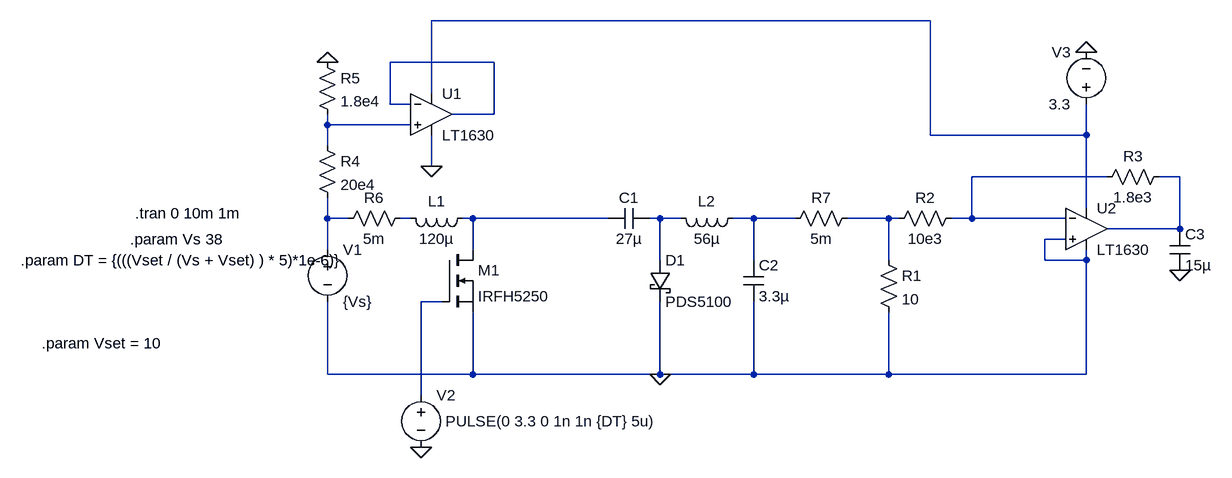
[diagram p0: schematic cuk_converter2.asc]
cuk_converter2.asc, the LTspice schematic file:
Version 4
SHEET 1 1320 680
WIRE 880 -208 112 -208
WIRE 208 -144 48 -144
WIRE 112 -96 112 -208
WIRE 48 -80 48 -144
WIRE 80 -80 48 -80
WIRE 208 -64 208 -144
WIRE 208 -64 144 -64
WIRE -48 -48 -48 -64
WIRE 80 -48 -48 -48
WIRE 880 -32 880 -208
WIRE 1120 -32 1120 -80
WIRE 1120 -32 880 -32
WIRE -48 -16 -48 -48
WIRE 112 16 112 -32
WIRE 1152 32 944 32
WIRE 1264 32 1232 32
WIRE 1120 80 1120 -32
WIRE -48 96 -48 64
WIRE -16 96 -48 96
WIRE 80 96 64 96
WIRE 176 96 160 96
WIRE 384 96 176 96
WIRE 464 96 448 96
WIRE 496 96 464 96
WIRE 608 96 576 96
WIRE 672 96 608 96
WIRE 816 96 752 96
WIRE 832 96 816 96
WIRE 944 96 944 32
WIRE 944 96 912 96
WIRE 1088 96 944 96
WIRE 1264 112 1264 32
WIRE 1264 112 1152 112
WIRE 1088 128 1056 128
WIRE -48 144 -48 96
WIRE 176 144 176 96
WIRE 464 160 464 96
WIRE 608 160 608 96
WIRE 816 160 816 96
WIRE 1056 160 1056 128
WIRE 1120 160 1120 144
WIRE 1120 160 1056 160
WIRE 128 224 96 224
WIRE -48 336 -48 224
WIRE 176 336 176 240
WIRE 176 336 -48 336
WIRE 464 336 464 224
WIRE 464 336 176 336
WIRE 608 336 608 224
WIRE 608 336 464 336
WIRE 816 336 816 240
WIRE 816 336 608 336
WIRE 1120 336 1120 160
WIRE 1120 336 816 336
WIRE 96 368 96 224
FLAG 96 448 0
FLAG 464 336 0
FLAG 1120 -160 0
FLAG 112 16 0
FLAG -48 -144 0
FLAG 1264 176 0
SYMBOL voltage -48 128 R0
WINDOW 123 0 0 Left 2
WINDOW 39 0 0 Left 2
SYMATTR InstName V1
SYMATTR Value {Vs}
SYMBOL ind 176 80 R90
WINDOW 0 5 56 VBottom 2
WINDOW 3 32 56 VTop 2
SYMATTR InstName L1
SYMATTR Value 120µ
SYMBOL ind 592 80 R90
WINDOW 0 5 56 VBottom 2
WINDOW 3 32 56 VTop 2
SYMATTR InstName L2
SYMATTR Value 56µ
SYMBOL cap 448 80 R90
WINDOW 0 0 32 VBottom 2
WINDOW 3 32 32 VTop 2
SYMATTR InstName C1
SYMATTR Value 27µ
SYMBOL nmos 128 144 R0
SYMATTR InstName M1
SYMATTR Value IRFH5250
SYMBOL voltage 96 352 R0
WINDOW 123 0 0 Left 2
WINDOW 39 0 0 Left 2
WINDOW 3 38 56 Left 2
SYMATTR Value PULSE(0 3.3 0 1n 1n {DT} 5u)
SYMATTR InstName V2
SYMBOL schottky 448 160 R0
SYMATTR InstName D1
SYMATTR Value PDS5100
SYMATTR Description Diode
SYMATTR Type diode
SYMBOL res 800 144 R0
SYMATTR InstName R1
SYMATTR Value 10
SYMBOL cap 592 160 R0
SYMATTR InstName C2
SYMATTR Value 3.3µ
SYMBOL voltage 1120 -64 R180
WINDOW 0 24 96 Left 2
WINDOW 3 24 16 Left 2
WINDOW 123 0 0 Left 2
WINDOW 39 0 0 Left 2
SYMATTR InstName V3
SYMATTR Value 3.3
SYMBOL res 928 80 R90
WINDOW 0 0 56 VBottom 2
WINDOW 3 32 56 VTop 2
SYMATTR InstName R2
SYMATTR Value 10e3
SYMBOL res 1248 16 R90
WINDOW 0 0 56 VBottom 2
WINDOW 3 32 56 VTop 2
SYMATTR InstName R3
SYMATTR Value 1.8e3
SYMBOL res -64 -32 R0
SYMATTR InstName R4
SYMATTR Value 20e4
SYMBOL res -64 -160 R0
SYMATTR InstName R5
SYMATTR Value 1.8e4
SYMBOL cap 1248 112 R0
SYMATTR InstName C3
SYMATTR Value 15µ
SYMBOL res 80 80 R90
WINDOW 0 0 56 VBottom 2
WINDOW 3 32 56 VTop 2
SYMATTR InstName R6
SYMATTR Value 5m
SYMBOL res 768 80 R90
WINDOW 0 0 56 VBottom 2
WINDOW 3 32 56 VTop 2
SYMATTR InstName R7
SYMATTR Value 5m
SYMBOL Opamps\\LT1630 112 -128 R0
SYMATTR InstName U1
SYMBOL Opamps\\LT1630 1120 48 R0
SYMATTR InstName U2
TEXT -344 88 Left 2 !.tran 0 10m 1m
TEXT -520 160 Left 2 !.param DT = {(((Vset / (Vs + Vset) ) * 5)*1e-6)}
TEXT -352 128 Left 2 !.param Vs 38
TEXT -488 288 Left 2 !.param Vset = 10

The netlist it stands for:
* cuk_converter2.asc
V1 N006 0 {Vs}
L1 N008 N007 120µ
L2 N010 N009 56µ
C1 N009 N008 27µ
M1 N008 N012 0 0 IRFH5250
V2 N012 0 PULSE(0 3.3 0 1n 1n {DT} 5u)
D1 N009 0 PDS5100
R1 N011 0 10
C2 N010 0 3.3µ
V3 N001 0 3.3
R2 N004 N011 10e3
R3 N005 N004 1.8e3
R4 N003 N006 20e4
R5 0 N003 1.8e4
C3 N005 0 15µ
R6 N007 N006 5m
R7 N011 N010 5m
XU1 N003 N002 N001 0 N002 LT1630  ; pins In+ In- V+ V- OUT
XU2 0 N004 N001 0 N005 LT1630  ; pins In+ In- V+ V- OUT
.model D D
.lib standard.dio
.model NMOS NMOS
.model PMOS PMOS
.lib standard.mos
.tran 0 10m 1m
.param DT = {(((Vset / (Vs + Vset) ) * 5)*1e-6)}
.param Vs 38
.param Vset = 10
.backanno
.end